# EAGLE design keychange (EAGLE 7.0.0)
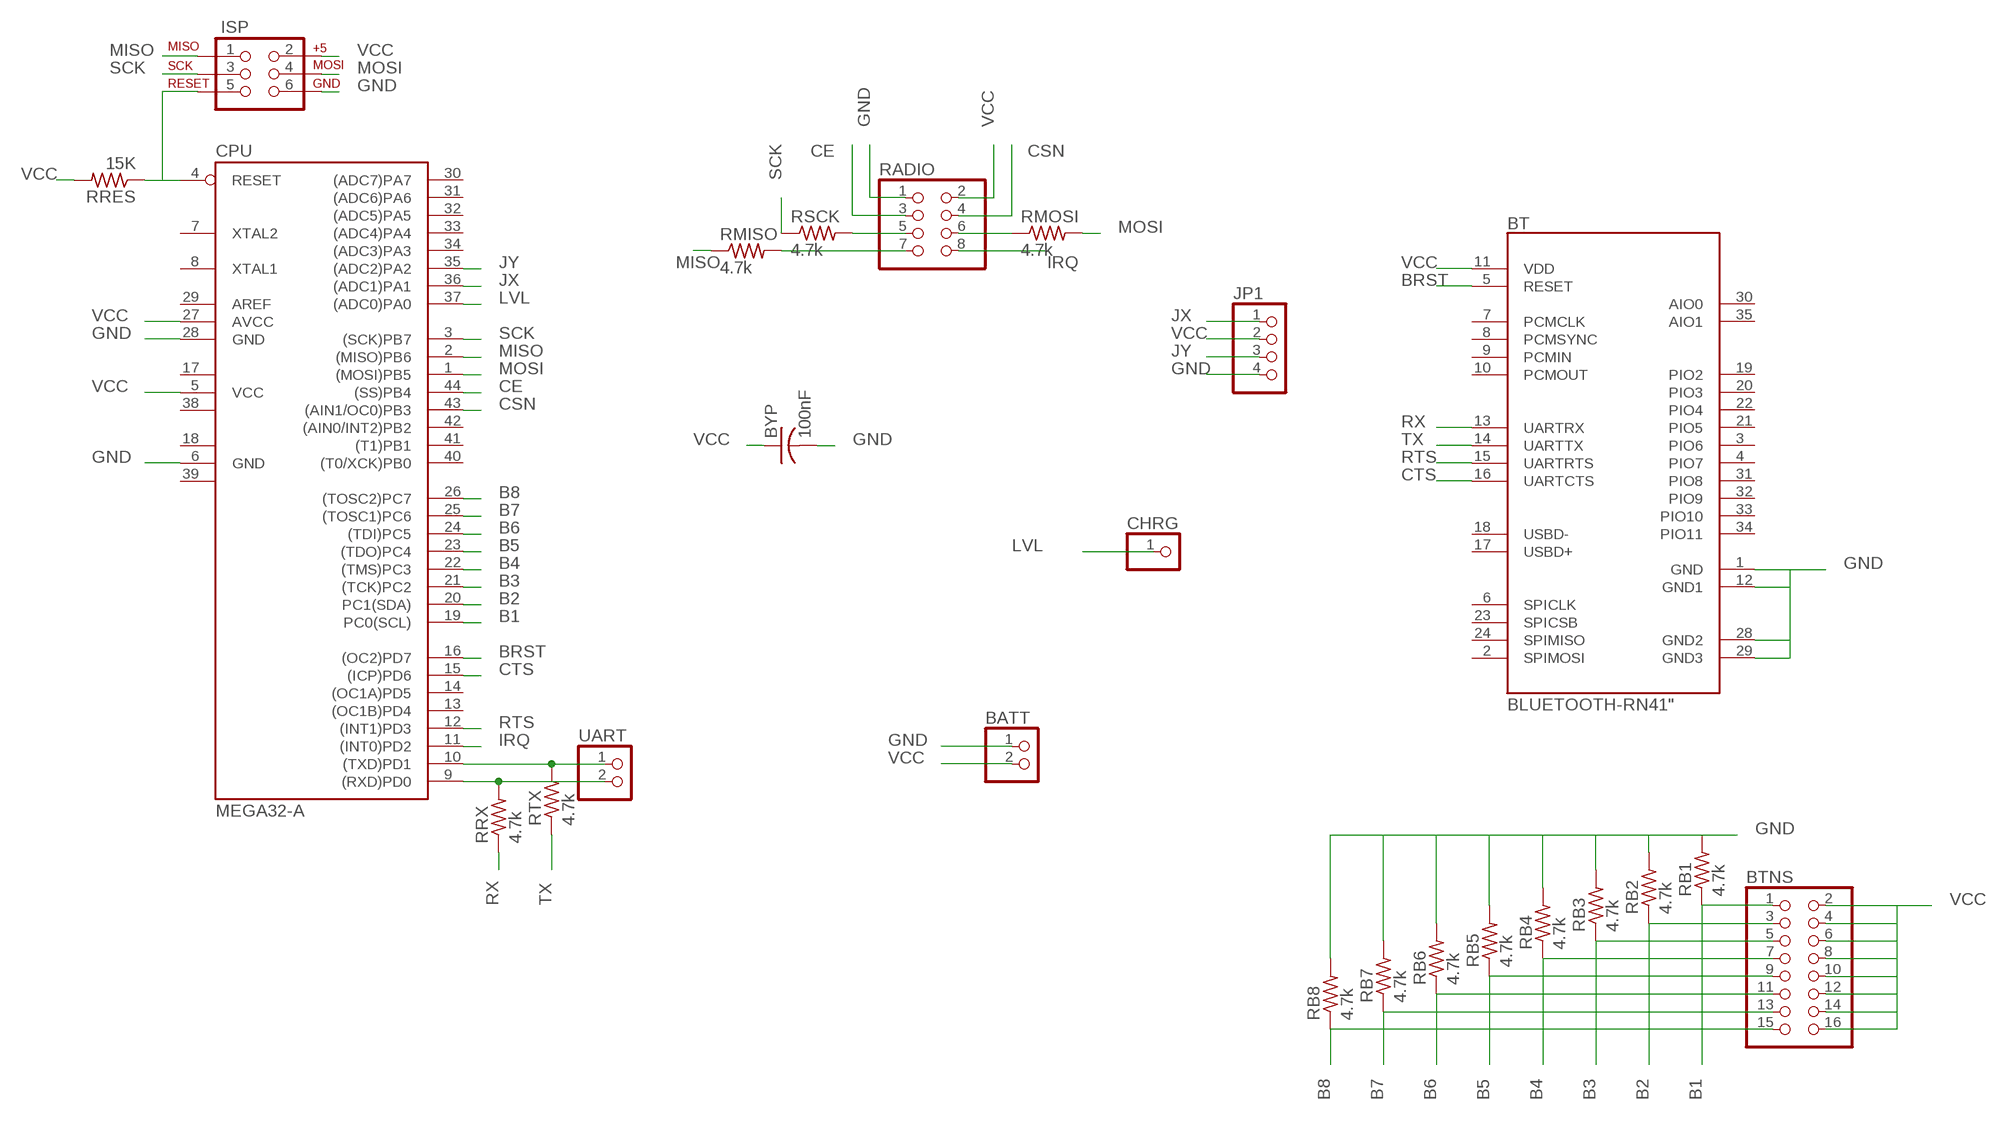
[diagram p0: schematic, sheet 1]

## Parts
BATT  PINHD-1X2  [1X02]
BT  BLUETOOTH-RN41"  [RN41]
BTNS  PINHD-2X8  [2X08]
BYP  100nF  C-USC0603  [C0603]
CHRG  PINHD-1X1  [1X01]
CPU  MEGA32-A  [TQFP44]
ISP  AVR_SPI_PRG_62X3_LOCK  [2X3_LOCK]
JP1  PINHD-1X4  [1X04]
RADIO  PINHD-2X4  [2X04]
RB1  4.7k  R-US_R0603  [R0603]
RB2  4.7k  R-US_R0603  [R0603]
RB3  4.7k  R-US_R0603  [R0603]
RB4  4.7k  R-US_R0603  [R0603]
RB5  4.7k  R-US_R0603  [R0603]
RB6  4.7k  R-US_R0603  [R0603]
RB7  4.7k  R-US_R0603  [R0603]
RB8  4.7k  R-US_R0603  [R0603]
RMISO  4.7k  R-US_R0603  [R0603]
RMOSI  4.7k  R-US_R0603  [R0603]
RRES  15K  R-US_R0603  [R0603]
RRX  4.7k  R-US_R0603  [R0603]
RSCK  4.7k  R-US_R0603  [R0603]
RTX  4.7k  R-US_R0603  [R0603]
UART  PINHD-1X2  [1X02]

## Nets
B1: BTNS.1 CPU.19(PC0(SCL)) RB1.1
B2: BTNS.3 CPU.20(PC1(SDA)) RB2.1
B3: BTNS.5 CPU.21((TCK)PC2) RB3.1
B4: BTNS.7 CPU.22((TMS)PC3) RB4.1
B5: BTNS.9 CPU.23((TDO)PC4) RB5.1
B6: BTNS.11 CPU.24((TDI)PC5) RB6.1
B7: BTNS.13 CPU.25((TOSC1)PC6) RB7.1
B8: BTNS.15 CPU.26((TOSC2)PC7) RB8.1
BRST: BT.5(RESET) CPU.16((OC2)PD7)
CE: CPU.44((SS)PB4) RADIO.3
CSN: CPU.43((AIN1/OC0)PB3) RADIO.4
CTS: BT.16(UARTCTS) CPU.15((ICP)PD6)
GND: BATT.1 BT.1(GND) BT.12(GND1) BT.28(GND2) BT.29(GND3) BYP.2 CPU.6(GND) CPU.28(GND) ISP.6 JP1.4 RADIO.1 RB1.2 RB2.2 RB3.2 RB4.2 RB5.2 RB6.2 RB7.2 RB8.2
IRQ: CPU.11((INT0)PD2) RADIO.8
JX: CPU.36((ADC1)PA1) JP1.1
JY: CPU.35((ADC2)PA2) JP1.3
LVL: CHRG.1 CPU.37((ADC0)PA0)
MISO: CPU.2((MISO)PB6) ISP.1 RMISO.1
MOSI: CPU.1((MOSI)PB5) ISP.4 RMOSI.2
N$1: RADIO.5 RSCK.2
N$2: RADIO.6 RMOSI.1
N$4: CPU.4(RESET) ISP.5 RRES.1
N$5: CPU.10((TXD)PD1) RTX.2 UART.1
N$6: CPU.9((RXD)PD0) RRX.2 UART.2
N$10: RADIO.7 RMISO.2
RTS: BT.15(UARTRTS) CPU.12((INT1)PD3)
RX: BT.13(UARTRX) RRX.1
SCK: CPU.3((SCK)PB7) ISP.3 RSCK.1
TX: BT.14(UARTTX) RTX.1
VCC: BATT.2 BT.11(VDD) BTNS.2 BTNS.4 BTNS.6 BTNS.8 BTNS.10 BTNS.12 BTNS.14 BTNS.16 BYP.1 CPU.5(VCC) CPU.27(AVCC) ISP.2 JP1.2 RADIO.2 RRES.2
Unconnected: BT.2(SPIMOSI) BT.3(PIO6) BT.4(PIO7) BT.6(SPICLK) BT.7(PCMCLK) BT.8(PCMSYNC) BT.9(PCMIN) BT.10(PCMOUT) BT.17(USBD+) BT.18(USBD-) BT.19(PIO2) BT.20(PIO3) BT.21(PIO5) BT.22(PIO4) BT.23(SPICSB) BT.24(SPIMISO) BT.30(AIO0) BT.31(PIO8) BT.32(PIO9) BT.33(PIO10) BT.34(PIO11) BT.35(AIO1) CPU.7(XTAL2) CPU.8(XTAL1) CPU.13((OC1B)PD4) CPU.14((OC1A)PD5) CPU.29(AREF) CPU.30((ADC7)PA7) CPU.31((ADC6)PA6) CPU.32((ADC5)PA5) CPU.33((ADC4)PA4) CPU.34((ADC3)PA3) CPU.40((T0/XCK)PB0) CPU.41((T1)PB1) CPU.42((AIN0/INT2)PB2)

## Power pins joined to a net without a drawn wire
GND1: CPU.18(GND1)
GND2: CPU.39(GND2)
VCC1: CPU.17(VCC1)
VCC2: CPU.38(VCC2)

## Library data of the parts
BATT UART = pinhead:PINHD-1X2: PIN HEADER
BT = SparkFun-RF:BLUETOOTH-RN41: Bluetooth SMD module
BTNS = pinhead:PINHD-2X8: PIN HEADER
BYP = rcl:C-US: CAPACITOR, American symbol
CHRG = pinhead:PINHD-1X1: PIN HEADER
CPU = atmel:MEGA32: MICROCONTROLLER 32 Kbytes FLASH 2 Kbytes SRAM 1 Kbytes EEPROM USART 8-channel 10 bit ADC Source: www.atmel.com .. doc2503.pdf; MPN: ATMEGA32-16AU; OC_FARNELL: 9171274; OC_NEWARK: 69K6677
ISP = SparkFun-Connectors:AVR_SPI_PRG_6: AVR ISP 6 Pin This is the reduced ISP connector for AVR programming. Common on Arduino. This footprint will take up less PCB space and can be used with a 10-pin to 6-pin adapter such as SKU: BOB-08508 **Special note about "TEST_POINT" package. The stop mask is on the top side, so if you want your programming test points to be on the bottom of your board, make sure to place this package on the bottom side of the board. This also ensure that the orientation to program from the bottom side will be correct.
JP1 = pinhead:PINHD-1X4: PIN HEADER
RADIO = pinhead:PINHD-2X4: PIN HEADER
RB1-RB8 RMISO RMOSI RRES RRX RSCK RTX = resistor:R-US_: RESISTOR, American symbol

## Board
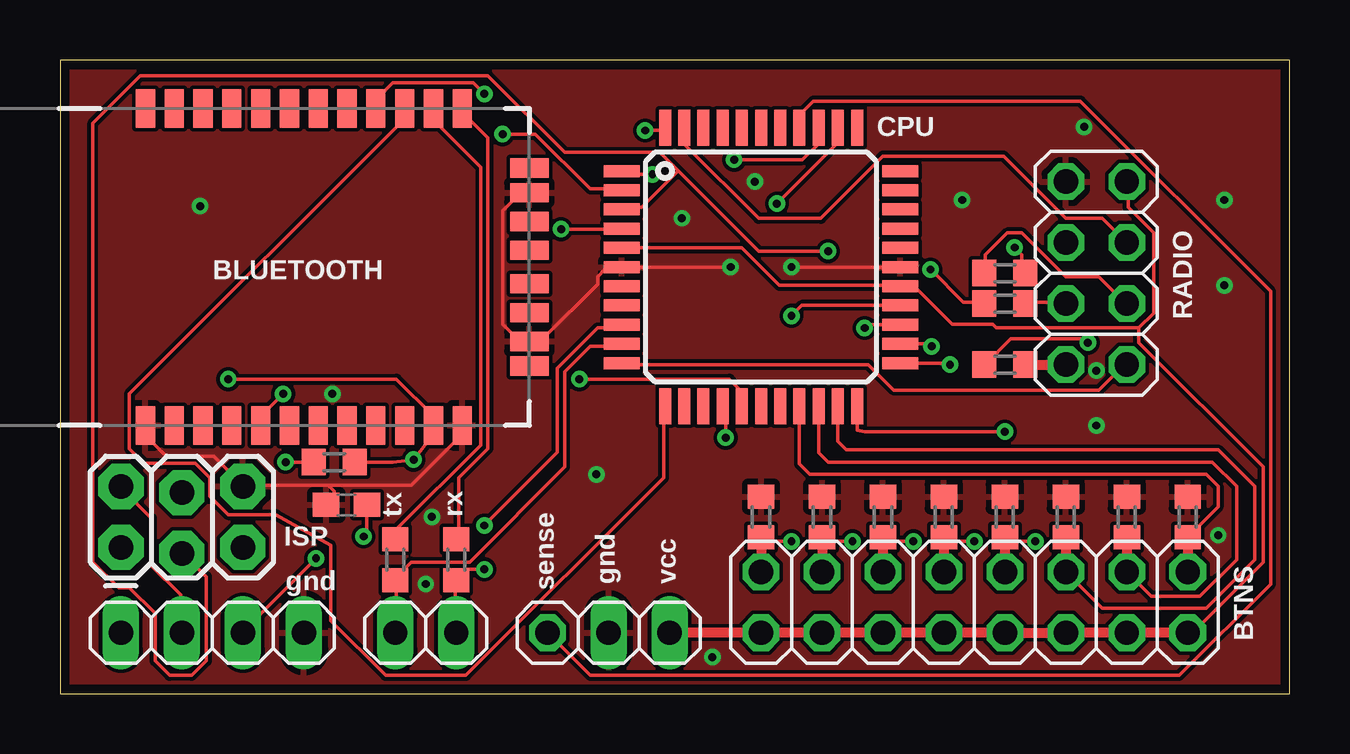
[diagram p1: board, top side]
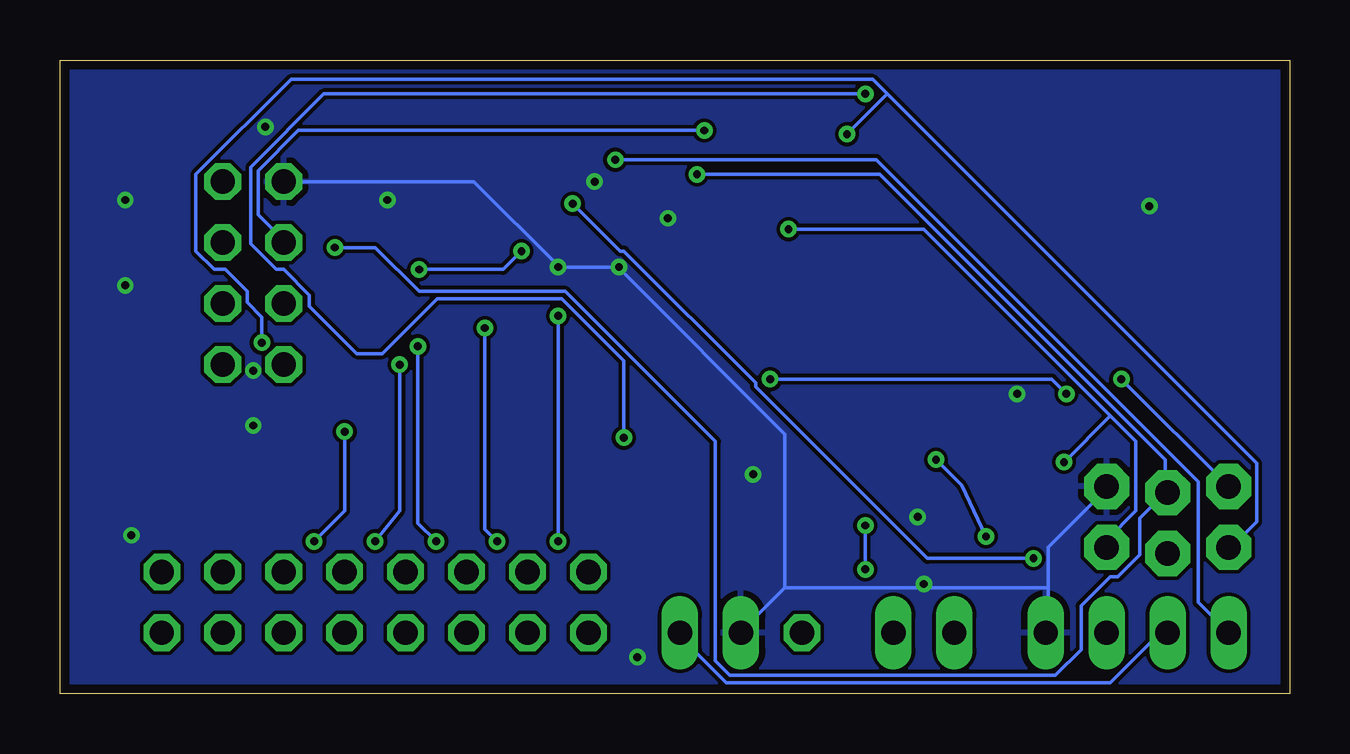
[diagram p2: board, bottom side, seen from below]

Size 51.23 x 26.41 mm. Coordinates in mm from the lower left corner, seen from the top.
Outline: 0,0 51.23,0 51.23,26.41 0,26.41 0,0
Copper layers (1*16): Top 0.0356mm / dielectric 1.5011mm / Bottom 0.0356mm
Design rules "OSHpark": minimum track width 6mil, minimum drill 13mil, track to track 6mil, track to pad 6mil, pad to pad 6mil, via to via 6mil, smd to smd 6mil, copper to edge 15mil, drill to drill 6mil, minimum pad ring 7mil, minimum via ring 7mil, stop-mask expansion 3mil, vias tented up to drill 18mil, thermal gap 10mil

### Footprints (pad centres in the part's own frame; a part is rotated, then mirrored left to right if it is on the bottom)
1X02 = drill 1.016 long: 1 -1.27,0; 2 1.27,0
RN41 = smd 0.8 x 1.6: 1 -6.6,-6.6; 2 -5.4,-6.6; 3 -4.2,-6.6; 4 -3,-6.6; 5 -1.8,-6.6; 6 -0.6,-6.6; 7 0.6,-6.6; 8 1.8,-6.6; 9 3,-6.6; 10 4.2,-6.6; 11 5.4,-6.6; 12 6.6,-6.6; 13 6.6,6.6; 14 5.4,6.6; 15 4.2,6.6; 16 3,6.6; 17 1.8,6.6; 18 0.6,6.6; 19 -0.6,6.6; 20 -1.8,6.6; 21 -3,6.6; 22 -4.2,6.6; 23 -5.4,6.6; 24 -6.6,6.6 | smd 1.6 x 0.8: 28 9.4,3.1; 29 9.4,-3.1; 30 9.4,4.122; 31 9.4,1.9; 32 9.4,0.7; 33 9.4,-0.7; 34 9.4,-1.9; 35 9.4,-4.122
2X08 = drill 1.016 octagon: 1 -8.89,-1.27; 2 -8.89,1.27; 3 -6.35,-1.27; 4 -6.35,1.27; 5 -3.81,-1.27; 6 -3.81,1.27; 7 -1.27,-1.27; 8 -1.27,1.27; 9 1.27,-1.27; 10 1.27,1.27; 11 3.81,-1.27; 12 3.81,1.27; 13 6.35,-1.27; 14 6.35,1.27; 15 8.89,-1.27; 16 8.89,1.27
C0603 = smd 1.1 x 1: 1 -0.85,0; 2 0.85,0
1X01 = drill 1.016 octagon: 1 0,0
TQFP44 = smd 1.5 x 0.5: 1 -5.8,4; 2 -5.8,3.2; 3 -5.8,2.4; 4 -5.8,1.6; 5 -5.8,0.8; 6 -5.8,0; 7 -5.8,-0.8; 8 -5.8,-1.6; 9 -5.8,-2.4; 10 -5.8,-3.2; 11 -5.8,-4; 23 5.8,-4; 24 5.8,-3.2; 25 5.8,-2.4; 26 5.8,-1.6; 27 5.8,-0.8; 28 5.8,0; 29 5.8,0.8; 30 5.8,1.6; 31 5.8,2.4; 32 5.8,3.2; 33 5.8,4 | smd 0.5 x 1.5: 12 -4,-5.8; 13 -3.2,-5.8; 14 -2.4,-5.8; 15 -1.6,-5.8; 16 -0.8,-5.8; 17 0,-5.8; 18 0.8,-5.8; 19 1.6,-5.8; 20 2.4,-5.8; 21 3.2,-5.8; 22 4,-5.8; 34 4,5.8; 35 3.2,5.8; 36 2.4,5.8; 37 1.6,5.8; 38 0.8,5.8; 39 0,5.8; 40 -0.8,5.8; 41 -1.6,5.8; 42 -2.4,5.8; 43 -3.2,5.8; 44 -4,5.8
2X3_LOCK = drill 1.016 pad 1.88 octagon: 1 0,0; 2 0,2.54; 3 2.54,-0.254; 4 2.54,2.286; 5 5.08,0; 6 5.08,2.54
1X04 = drill 1.016 long: 1 -3.81,0; 2 -1.27,0; 3 1.27,0; 4 3.81,0
2X04 = drill 1.016 octagon: 1 -3.81,-1.27; 2 -3.81,1.27; 3 -1.27,-1.27; 4 -1.27,1.27; 5 1.27,-1.27; 6 1.27,1.27; 7 3.81,-1.27; 8 3.81,1.27
R0603 = smd 1 x 1.1: 1 -0.85,0; 2 0.85,0

### Placement (x,y rotation side)
BATT  24.13,2.54 0 top
BT  10.16,17.78 0 top
BTNS  38.1,3.81 180 top
BYP  11.94,7.87 180 top
CHRG  20.32,2.54 0 top
CPU  29.21,17.78 0 top
ISP  2.54,6.1 0 top
JP1  6.35,2.54 0 top
RADIO  43.18,17.53 270 top
RB1  46.99,7.37 90 top
RB2  44.45,7.37 90 top
RB3  41.91,7.37 90 top
RB4  39.37,7.37 90 top
RB5  36.83,7.37 90 top
RB6  34.29,7.37 90 top
RB7  31.75,7.37 90 top
RB8  29.21,7.37 90 top
RMISO  39.37,13.72 0 top
RMOSI  39.37,17.53 0 top
RRES  11.43,9.65 0 top
RRX  16.51,5.59 270 top
RSCK  39.37,16.26 0 top
RTX  13.97,5.59 270 top
UART  15.24,2.54 0 top

### Tracks (layer width: path | path; a pad name or v marks a point on that pad's centre or on a via)
B1
  Top 0.152: CPU.19 30.81,9.58 31.24,9.14 47.75,9.14 48.26,8.64 48.26,7.79 RB1.1
  Top 0.406: RB1.1 BTNS.1
B2
  Top 0.152: CPU.20 31.61,10.05 32,9.65 48.01,9.65 49.02,8.64 49.02,5.59 47.5,4.06 45.47,4.06 BTNS.3
  Top 0.406: RB2.1 BTNS.3
B3
  Top 0.152: CPU.21 32.41,10.52 32.77,10.16 48.26,10.16 49.78,8.64 49.78,5.59 47.75,3.56 43.43,3.56 BTNS.5
  Top 0.406: RB3.1 BTNS.5
B4  (via drill 0.33)
  Top 0.152: CPU.22 33.21,10.99 33.53,10.92 v39.37,10.92 | v40.64,6.35 39.54,6.35 RB4.1
  Top 0.406: RB4.1 BTNS.7
  Bottom 0.152: v39.37,10.92 39.37,7.62 v40.64,6.35
B5  (via drill 0.33)
  Top 0.152: CPU.23 37.02,13.78 v37.08,13.72 | v38.1,6.35 37,6.35 RB5.1
  Top 0.406: RB5.1 BTNS.9
  Bottom 0.152: v37.08,13.72 37.08,7.62 v38.1,6.35
B6  (via drill 0.33)
  Top 0.152: CPU.24 36.22,14.58 v36.32,14.48 | v35.56,6.35 34.46,6.35 RB6.1
  Top 0.406: RB6.1 BTNS.11
  Bottom 0.152: v36.32,14.48 36.32,7.11 v35.56,6.35
B7  (via drill 0.33)
  Top 0.152: CPU.25 33.67,15.38 v33.53,15.24 | v33.02,6.35 31.92,6.35 RB7.1
  Top 0.406: RB7.1 BTNS.13
  Bottom 0.152: v33.53,15.24 33.53,6.86 v33.02,6.35
B8  (via drill 0.33)
  Top 0.152: CPU.26 30.91,16.18 v30.48,15.75 | v30.48,6.35 29.38,6.35 RB8.1
  Top 0.406: RB8.1 BTNS.15
  Bottom 0.152: v30.48,15.75 v30.48,6.35
BRST  (via drill 0.33)
  Top 0.152: v21.64,13.11 27.89,13.11 28.35,12.65 28.35,12.04 CPU.16 | v9.3,12.5 8.38,11.58 8.38,11.28 BT.5
  Bottom 0.152: v21.64,13.11 9.91,13.11 v9.3,12.5
CE  (via drill 0.33)
  Top 0.152: v24.38,23.47 25.15,23.47 CPU.44
  Bottom 0.152: v24.38,23.47 41.3,23.47 42.98,21.79 42.98,19.96 41.91,18.9 RADIO.3
CSN
  Top 0.152: RADIO.4 43.43,19.81 41.91,19.81 39.32,22.4 34.29,22.4 31.7,19.81 29.11,19.81 26.06,22.86 26.06,23.47 CPU.43
CTS  (via drill 0.33)
  Top 0.152: v27.74,10.67 27.74,11.89 CPU.15 | v17.68,24.99 17.22,25.45 13.87,25.45 13.26,24.84 13.26,24.38 BT.16
  Bottom 0.152: v27.74,10.67 27.74,13.87 30.33,16.46 35.51,16.46 37.8,14.17 38.86,14.17 40.84,16.15 40.84,16.61 41.91,17.68 42.22,17.68 43.28,18.75 43.28,21.95 40.23,24.99 v17.68,24.99
GND  (via drill 0.33)
  Top 0.152: CPU.28 v30.48,17.78 | v27.94,17.78 CPU.6 23.32,17.68 22.71,17.68 22.4,17.37 22.4,17.07 20.12,14.78 19.66,14.78 BT.29 19.51,14.78 19.05,14.78 18.44,15.39 18.44,20.12 19.2,20.88 19.51,20.88 BT.28 | 7.62,8.69 6.4,9.91 4.42,9.91 3.66,10.67 3.66,11.12 BT.1 | 7.62,8.69 11.18,8.69 | 11.18,8.69 14.63,8.69 16.61,10.67 16.61,11.12 BT.12 | 7.62,8.69 ISP.6 | 11.18,8.69 11.43,8.43 11.43,8.08 11.29,8.08 BYP.2
  Bottom 0.152: 10.06,4.42 10.06,6.1 7.62,8.53 ISP.6 | 10.06,4.42 10.06,2.59 JP1.4 | 21.03,4.42 10.06,4.42 | 21.03,4.42 22.86,2.59 BATT.1 | RADIO.1 33.98,21.34 30.48,17.83 v30.48,17.78 v27.94,17.78 27.89,17.68 21.03,10.82 21.03,4.42
  other vias: 22.35,9.14 25.91,19.81 37.59,20.57 48.51,20.57 48.51,17.02 5.84,20.32 43.18,11.18 27.18,1.52 15.24,4.57 28.96,21.34 15.49,7.37 48.26,6.6 11.35,12.5 43.18,13.46 42.67,23.62
  pour Bottom: 0,26.42 51.31,26.42 51.31,0 0,0
  pour Top: 0,26.42 51.31,26.42 51.31,0 0,0
IRQ
  Top 0.152: CPU.11 23.47,13.72 33.68,13.72 34.75,12.65 43.28,12.65 44.35,13.72 RADIO.8
JX  (via drill 0.33)
  Top 0.152: v28.09,22.25 30.94,22.25 31.55,22.86 31.55,23.47 CPU.36
  Bottom 0.152: v28.09,22.25 17.22,22.25 3.81,8.84 3.81,3.81 JP1.1
JY  (via drill 0.33)
  Top 0.152: v29.87,20.42 32.31,22.86 32.31,23.47 CPU.35 | v10.67,5.64 7.62,2.59 JP1.3
  Bottom 0.152: v29.87,20.42 27.89,18.44 27.74,18.44 22.25,12.95 22.25,12.8 15.09,5.64 v10.67,5.64
LVL
  Top 0.152: CHRG.1 22.1,0.76 46.63,0.76 50.44,4.57 50.44,16.76 42.52,24.69 31.39,24.69 30.94,24.23 30.94,23.62 CPU.37
MISO  (via drill 0.33)
  Top 0.152: v42.82,14.63 42.67,14.78 39.62,14.78 38.56,13.72 RMISO.1 | v18.44,23.32 19.81,23.32 22.1,21.03 23.32,21.03 CPU.2
  Bottom 0.152: v42.82,14.63 42.82,15.7 43.43,16.31 43.43,16.76 44.35,17.68 44.81,17.68 45.57,18.44 45.57,21.64 41.6,25.6 17.37,25.6 16.76,24.99 | 16.76,24.99 1.37,9.6 1.37,7.16 2.44,6.1 ISP.1 | 16.76,24.99 v18.44,23.32
MOSI  (via drill 0.33)
  Top 0.152: v39.78,18.59 40.08,18.29 40.08,17.53 RMOSI.2 | v24.69,21.64 23.47,21.64 CPU.1
  Bottom 0.152: v39.78,18.59 38.1,18.59 36.27,16.76 30.18,16.76 23.93,10.52 23.93,1.37 23.32,0.76 9.75,0.76 8.69,1.83 8.69,3.66 7.47,4.88 7.16,4.88 6.25,5.79 6.25,7.32 5.18,8.38 | v24.69,21.64 17.07,21.64 5.18,9.75 5.18,8.38 | 5.18,8.38 ISP.4
N$1
  Top 0.152: RSCK.2 40.23,16.31 41.91,16.31 RADIO.5
N$2
  Top 0.152: RMOSI.1 38.56,17.53 38.56,18.29 39.47,19.2 40.08,19.2 41.91,17.37 43.28,17.37 44.35,16.31 RADIO.6
N$4  (via drill 0.33)
  Top 0.152: v20.88,19.36 23.32,19.36 CPU.4 | RRES.1 v9.4,9.65
  Bottom 0.152: v20.88,19.36 15.24,19.36 7.47,11.58 | 7.47,11.58 6.4,10.52 6.4,7.62 7.62,6.4 ISP.5 | v9.4,9.65 7.47,11.58
N$5
  Top 0.152: UART.1 14.02,2.59 14.02,4.72 RTX.2 14.02,4.88 14.63,5.49 17.07,5.49 21.03,9.45 21.03,13.41 22.1,14.48 23.32,14.48 CPU.10
N$6  (via drill 0.33)
  Top 0.152: UART.2 16.46,2.59 16.46,4.72 RRX.2 16.61,4.88 16.92,5.18 v17.68,5.18 | v17.68,7.01 20.73,10.06 20.73,13.56 22.4,15.24 23.32,15.24 CPU.9
  Bottom 0.152: v17.68,5.18 v17.68,7.01
N$10
  Top 0.406: RMISO.2 RADIO.7
RTS
  Top 0.152: CPU.12 25.15,11.89 25.15,8.99 16.92,0.76 13.56,0.76 11.28,3.05 11.28,6.2 8.99,7.47 7.01,7.47 6.25,8.23 6.25,8.99 5.64,9.6 3.5,9.6 2.9,10.21 2.9,12.5 14.33,23.93 14.33,24.23 BT.15
RX
  Top 0.152: RRX.1 16.61,6.55 16.61,8.99 17.83,10.21 17.83,23.16 16.76,24.23 BT.13
SCK  (via drill 0.33)
  Top 0.152: v36.27,17.68 37.64,16.31 38.41,16.31 RSCK.1 | v32,18.44 29.11,18.44 25.76,21.79 | 25.76,21.79 24.99,22.55 21.03,22.55 17.83,25.76 3.35,25.76 1.37,23.77 1.37,5.49 2.44,4.42 2.9,4.42 3.96,3.35 3.96,1.37 4.57,0.76 5.49,0.76 6.1,1.37 6.1,4.88 5.18,5.79 ISP.3 | 25.76,21.79 24.23,20.27 23.47,20.27 CPU.3
  Bottom 0.152: v36.27,17.68 32.77,17.68 v32,18.44
TX
  Top 0.152: RTX.1 14.02,6.55 14.02,6.86 17.53,10.36 17.53,21.95 15.7,23.77 15.7,24.23 BT.14
VCC  (via drill 0.33)
  Top 0.152: CPU.5 28.41,18.58 29.97,17.02 34.97,17.02 CPU.27 35.05,16.92 35.66,16.92 37.19,15.39 38.86,15.39 39.01,15.24 44.96,15.24 | v7.01,13.11 14.02,13.11 15.54,11.58 15.54,11.28 BT.11 15.54,11.12 15.54,10.82 v14.73,9.75 13.87,9.65 RRES.2 | JP1.2 5.03,2.59 5.03,4.12 3.81,5.33 3.81,7.32 2.59,8.53 ISP.2 | 44.96,15.24 45.57,15.85 45.57,19.2 44.5,20.27 44.5,21.34 RADIO.2 | 44.96,15.24 44.96,14.63 50.14,9.45 50.14,5.49 47.09,2.44 BTNS.2 | BYP.1 12.79,6.69 v12.65,6.55
  Top 0.406: BTNS.2 BTNS.4 BTNS.6 BTNS.8 BTNS.10 BTNS.12 BTNS.14 BTNS.16 BATT.2
  Bottom 0.152: ISP.2 v7.01,13.11 | JP1.2 5.18,2.44 5.49,2.44 7.47,0.46 23.47,0.46 25.45,2.44 BATT.2 | v12.65,6.55 13.66,8.69 v14.73,9.75

### Text on the board
tNames: BLUETOOTH | tx | rx | gnd | vcc | gnd | sense